# Altium schematic sheet Breakout.SchDoc
size A4; DocumentNumber: 1; SheetNumber: 1
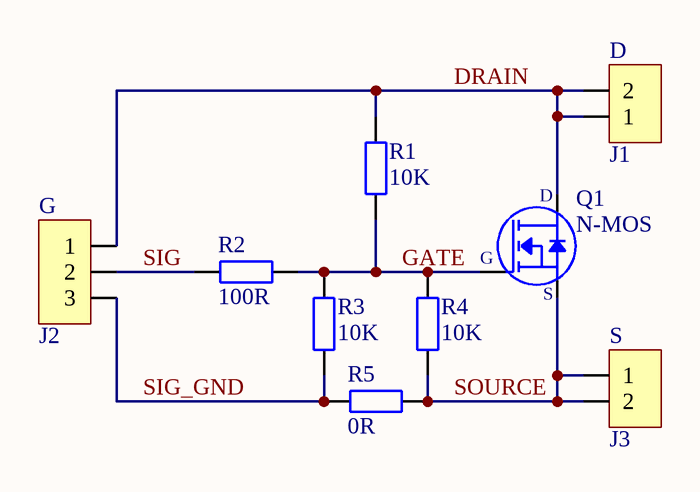
[diagram p0: Breakout.SchDoc]

## Parts
J1  D  [HEADER-2.54-2P1]
J2  G  [HEADER-2.54-3P1]
J3  S  [HEADER-2.54-2P1]
Q1  N-MOS  [IRLML_SOT-23]
R1  10K  [0603R_RF_M]
R2  100R  [0603R_RF_M]
R3  10K  [0603R_RF_M]
R4  10K  [0603R_RF_M]
R5  0R  [0603R_RF_M]

## Nets
DRAIN: J1.1 J1.2 J2.1 Q1.D(Drain) R1.1
GATE: Q1.G(Gate) R1.2 R2.2 R3.1 R4.1
SIG: J2.2 R2.1
SIG_GND: J2.3 R3.2 R5.2
SOURCE: J3.1 J3.2 Q1.S(Source) R4.2 R5.1

## Notes on the sheet
- Author
- Date
- Revision
- Size
- A4
- Sheet
- of

## Library data of the parts
J1 J3 = PINHDR-2P1: Pin Header Single Row 2 Positions; Mounting Technology: THT
J2 = PINHDR-3P1: Generic Pin Header 3x1
Q1 = N-MOS: MOSFET N-Channel; pin to pad: D>3 G>1 S>2; Manufacturer: Generic Brand; IGS: ? A; VDS: ? V; Power Rating: ? W; Manufacturer Part No: *; Supplier: *; Supplier Link: http://; Supplier Part No: *; Mounting Technology: SMT; Category: Transistor; VGS: ? V
R1-R5 = R: Resistor; Manufacturer: Generic Brand; Power Rating: ? W; Max Voltage: ? V; Tolerance: ?; Supplier Link: http://; Category: Resistor; Mounting Technology: SMT
  R1 R3 R4: Value: 10K
  R2: Value: 100R
  R5: Value: 0R